# EAGLE design untitled (EAGLE 7.7.0)
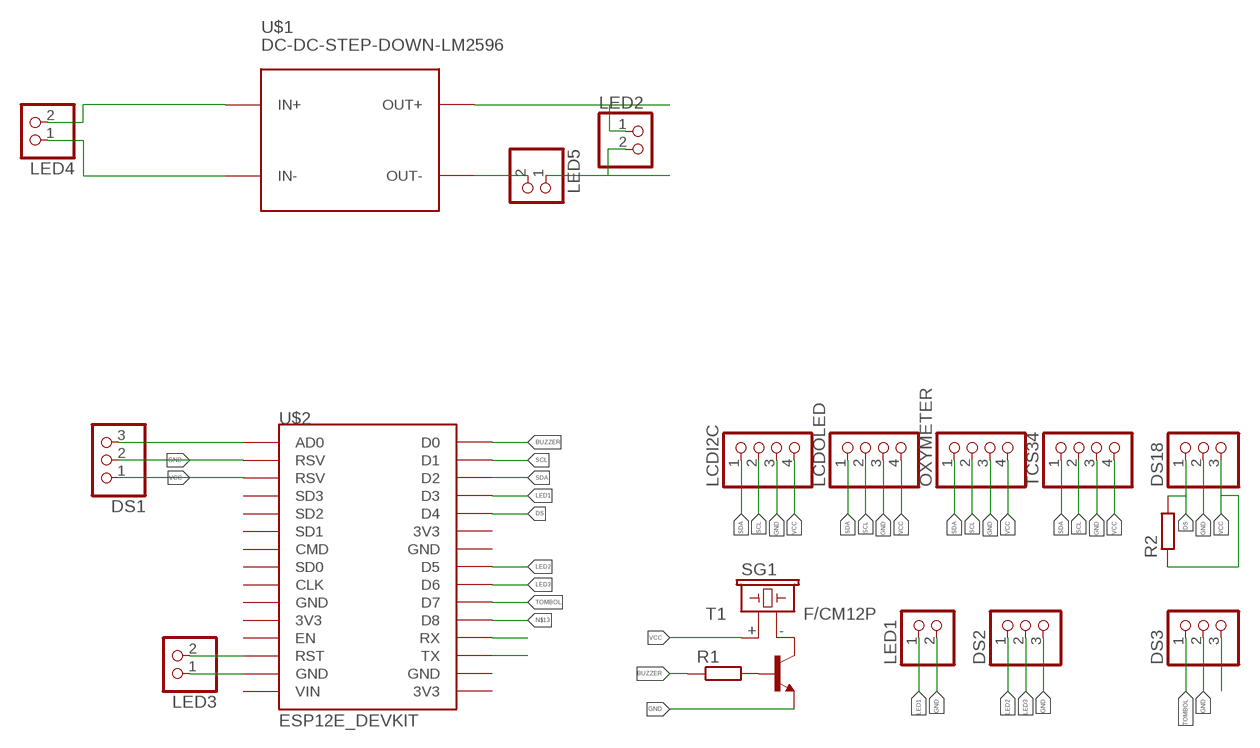
[diagram p0: schematic, sheet 1]

## Parts
DS1  PINHD-1X3  [1X03]
DS2  PINHD-1X3  [1X03]
DS3  PINHD-1X3  [1X03]
DS18  PINHD-1X3  [1X03]
LCDI2C  PINHD-1X4  [1X04]
LCDOLED  PINHD-1X4  [1X04]
LED1  PINHD-1X2  [1X02]
LED2  PINHD-1X2  [1X02]
LED3  PINHD-1X2  [1X02]
LED4  PINHD-1X2  [1X02]
LED5  PINHD-1X2  [1X02]
OXYMETER  PINHD-1X4  [1X04]
R1  R-EU_0207/10  [0207/10]
R2  R-EU_0207/10  [0207/10]
SG1  F/CM12P  [F/CM12P]
T1  -NPN-TO92  [TO92]
TCS34  PINHD-1X4  [1X04]
U$1  DC-DC-STEP-DOWN-LM2596  [DC-DC-STEP-DOWN-LM2596]
U$2  ESP12E_DEVKIT  [ESP12E_DEVKIT]

## Nets
BUZZER: R1.1 U$2.D0
DS: DS18.1 R2.2 U$2.D4
GND: DS1.2 DS2.3 DS3.2 DS18.2 LCDI2C.3 LCDOLED.3 LED1.2 LED2.2 LED5.1 OXYMETER.3 T1.1(E) TCS34.3 U$2.RSV@0(RSV)
LED1: LED1.1 U$2.D3
LED2: DS2.1 U$2.D5
LED3: DS2.2 U$2.D6
N$2: LED3.2 U$2.RST
N$3: SG1.- T1.3(C)
N$4: R1.2 T1.2(B)
N$5: LED4.2 U$1.IN+
N$6: LED4.1 U$1.IN-
N$7: LED5.2 U$1.OUT-
N$8: LED3.1 U$2.GND@1(GND)
N$13: U$2.D8
N$14: DS1.3 U$2.AD0
N$15: U$2.RX
N$16: U$2.TX
SCL: LCDI2C.2 LCDOLED.2 OXYMETER.2 TCS34.2 U$2.D1
SDA: LCDI2C.1 LCDOLED.1 OXYMETER.1 TCS34.1 U$2.D2
TOMBOL: DS3.1 U$2.D7
VCC: DS1.1 DS3.3 DS18.3 LCDI2C.4 LCDOLED.4 LED2.1 OXYMETER.4 R2.1 SG1.+ TCS34.4 U$1.OUT+ U$2.RSV@1(RSV)
Unconnected: U$2.3V3@0(3V3) U$2.3V3@1(3V3) U$2.3V3@2(3V3) U$2.CLK U$2.CMD U$2.EN U$2.GND@0(GND) U$2.GND@2(GND) U$2.GND@3(GND) U$2.SD0 U$2.SD1 U$2.SD2 U$2.SD3 U$2.VIN

## Library data of the parts
DS1-DS3 DS18 = pinhead:PINHD-1X3: PIN HEADER
LCDI2C LCDOLED OXYMETER TCS34 = pinhead:PINHD-1X4: PIN HEADER
LED1-LED5 = pinhead:PINHD-1X2: PIN HEADER
R1 R2 = rcl:R-EU_: RESISTOR, European symbol
SG1 = buzzer:F/CM12P: BUZZER Source: Buerklin
T1 = transistor:*-NPN-: NPN Transistror BF959 corrected 2008.03.06
U$1 = diy-modules:DC-DC-STEP-DOWN-LM2596: DC/DC Step-Down Regulator based on LM2596-ADJ chip LM2596 datasheet available here: http://www.ti.com/lit/ds/symlink/lm2596.pdf Click here to find device on ebay.com <http://www.ebay.com/sch/lm2596+power+regulator>
U$2 = ESP12E_DEVKIT:ESP12E_DEVKIT: ESP12E DEVKIT BOARD

## Board
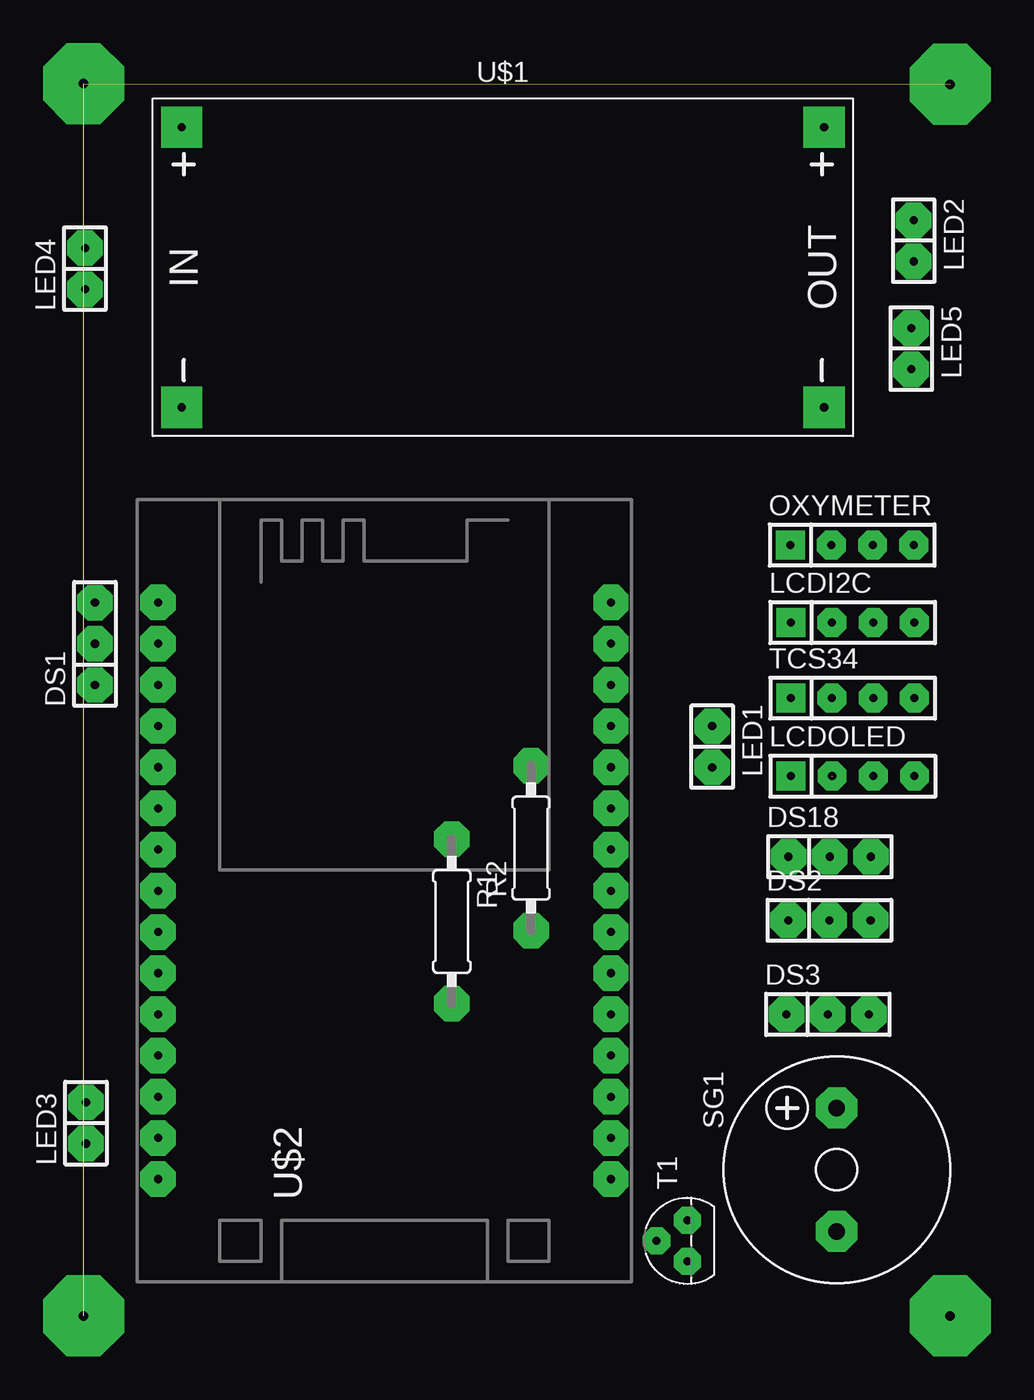
[diagram p1: board, top side]
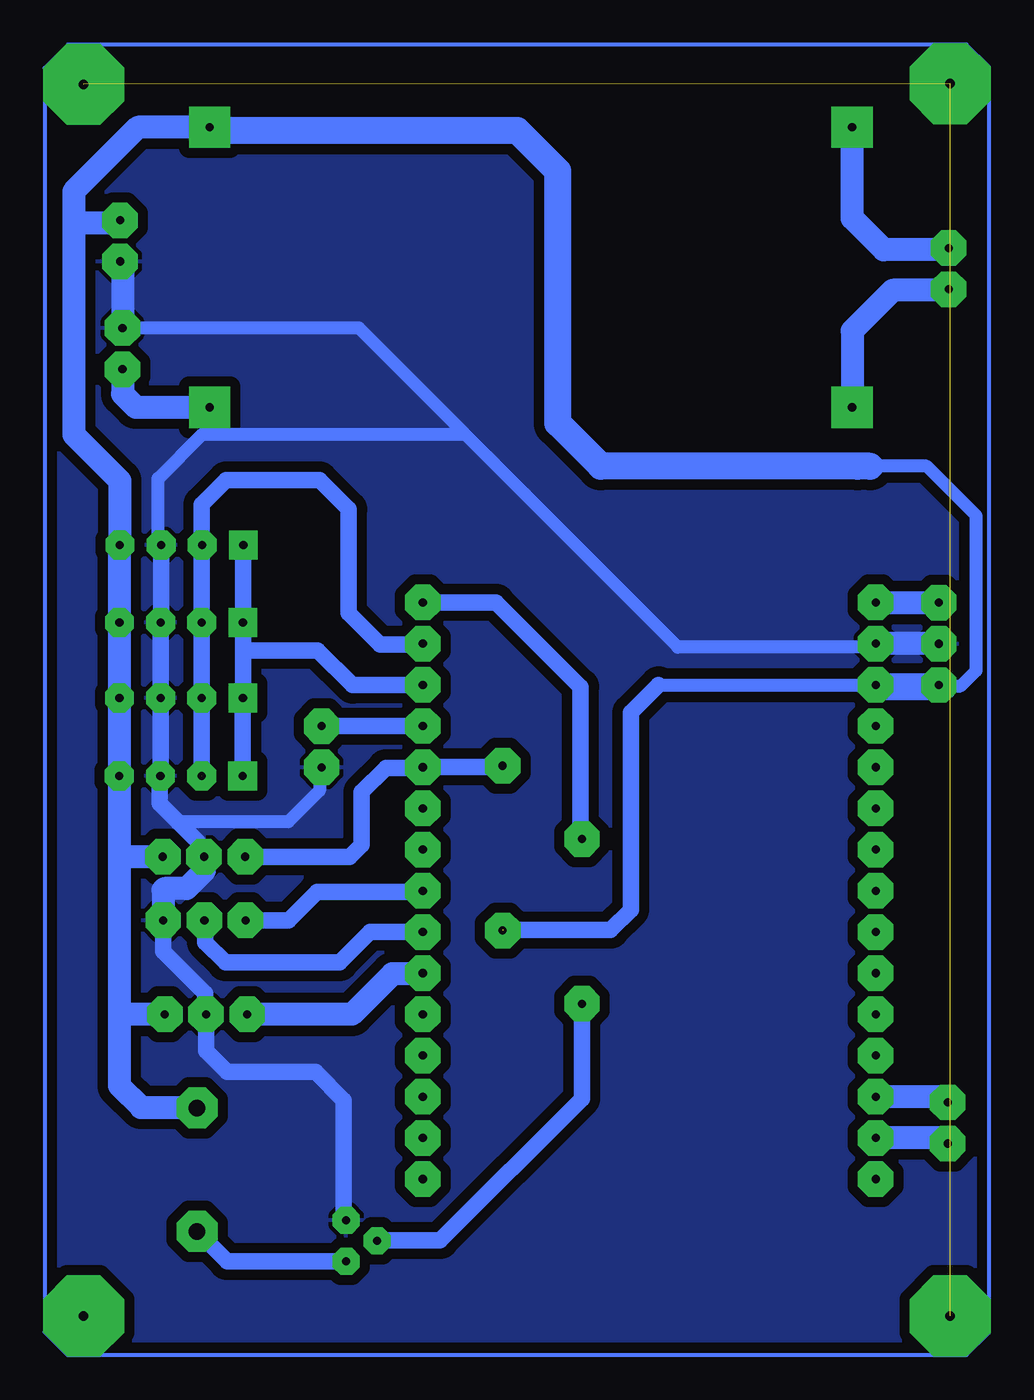
[diagram p2: board, bottom side, seen from below]

No outline drawn. Coordinates in mm, seen from the top.
Copper layers (1*16): Top 0.035mm / dielectric 1.5mm / Bottom 0.035mm
Design rules "default *": minimum track width 10mil, minimum drill 24mil, track to track 25mil, track to pad 25mil, pad to pad 25mil, via to via 25mil, smd to smd 25mil, copper to edge 40mil, drill to drill 25mil, minimum pad ring 10mil, minimum via ring 8mil, stop-mask expansion 4mil, vias tented up to drill 0mil, thermal gap 10mil

### Footprints (pad centres in the part's own frame; a part is rotated, then mirrored left to right if it is on the bottom)
1X03 = drill 0.5 pad 2.184 octagon: 1 -2.54,0; 2 0,0; 3 2.54,0
1X04 = drill 0.5 pad 1.778 square: 1 -3.81,0 | drill 0.5 pad 1.778 octagon: 2 -1.27,0; 3 1.27,0; 4 3.81,0
1X02 = drill 0.5 pad 2.184 octagon: 1 -1.27,0; 2 1.27,0
0207/10 = drill 0.5 pad 2.184 octagon: 1 -5.08,0; 2 5.08,0
F/CM12P = drill 1.016 pad 2.54 octagon: + 3.81,0; - -3.81,0
TO92 = drill 0.5 pad 1.676 octagon: 1 1.27,0; 2 0,1.905; 3 -1.27,0
DC-DC-STEP-DOWN-LM2596 = drill 0.5 pad 2.54 square: IN+ -19.812,8.636; IN- -19.812,-8.636; OUT+ 19.812,8.636; OUT- 19.812,-8.636
ESP12E_DEVKIT = drill 0.5 pad 2.184 octagon: 3V3@0 -11.43,-7.62; 3V3@1 16.51,5.08; 3V3@2 16.51,-17.78; AD0 -11.43,17.78; CLK -11.43,-2.54; CMD -11.43,2.54; D0 16.51,17.78; D1 16.51,15.24; D2 16.51,12.7; D3 16.51,10.16; D4 16.51,7.62; D5 16.51,0; D6 16.51,-2.54; D7 16.51,-5.08; D8 16.51,-7.62; EN -11.43,-10.16; GND@0 -11.43,-5.08; GND@1 -11.43,-15.24; GND@2 16.51,2.54; GND@3 16.51,-15.24; RST -11.43,-12.7; RSV@0 -11.43,15.24; RSV@1 -11.43,12.7; RX 16.51,-10.16; SD0 -11.43,0; SD1 -11.43,5.08; SD2 -11.43,7.62; SD3 -11.43,10.16; TX 16.51,-12.7; VIN -11.43,-17.78

### Placement (x,y rotation side)
DS1  4.05,54.25 90 top
DS2  49.35,37.2 0 top
DS3  49.25,31.4 0 top
DS18  49.37,41.12 0 top
LCDI2C  50.78,55.56 0 top
LCDOLED  50.79,46.09 0 top
LED1  42.12,47.9 270 top
LED2  54.55,79.1 270 top
LED3  3.5,24.7 90 top
LED4  3.44,77.39 90 top
LED5  54.4,72.45 270 top
OXYMETER  50.75,60.34 0 top
R1  26.06,37.13 270 top
R2  30.95,41.65 90 top
SG1  49.8,21.82 90 top
T1  40.6,17.43 90 top
TCS34  50.78,50.9 0 top
U$1  29.21,77.47 0 top
U$2  19.37,39.02 0 top

### Tracks (layer width: path | path; a pad name or v marks a point on that pad's centre or on a via)
BUZZER
  Bottom 1.016: R1.1 26.15,42.3 26.15,51.6 31.35,56.8 U$2.D0
DS
  Bottom 1.016: R2.2 31.04,46.64 U$2.D4 35.92,46.6 38.15,46.6 39.65,45.1 39.65,41.85 40.38,41.12 DS18.1
GND
  Bottom 0.813: LED1.2 42.25,46.35 42.25,45.2 44.17,43.27 50.98,43.27 | U$2.RSV@0 8.15,54.05 20.15,54.05 33.27,67.17 | 33.27,67.17 39.82,73.72 LED5.1 | OXYMETER.3 52.2,60.52 52.2,64.45 49.48,67.17 33.27,67.17
  Bottom 1.016: 51.91,37.22 DS2.3 51.89,35.29 49.3,32.7 49.3,31.45 DS3.2 49.25,29.15 47.95,27.85 42.5,27.85 40.75,26.1 40.75,18.85 T1.1 | 52.05,60.34 OXYMETER.3 52.02,55.59 LCDI2C.3 TCS34.3 LCDOLED.3 52.1,46.04 52.1,44.4 50.98,43.27 49.37,41.67 DS18.2
  Bottom 1.422: DS18.2 49.35,41.1 49.35,40.25 50.45,39.15 51.8,39.15 51.89,39.06 DS2.3 | LED2.2 54.4,77.68 LED5.1 | DS1.2 U$2.RSV@0
  pour Bottom: 15.75,91.2 57.75,91.2 59.2,89.75 59.2,11.8 57.8,10.4 2.35,10.4 0.95,11.8 0.95,89.8 2.35,91.2 14.75,91.2
LED1
  Bottom 1.016: LED1.1 U$2.D3
LED2
  Bottom 1.016: U$2.D5 35.95,38.95 42.4,38.95 44.15,37.2 DS2.1
LED3
  Bottom 1.016: DS2.2 49.3,37.15 49.3,35.85 48.05,34.6 41,34.6 39.12,36.48 U$2.D6
N$1  (via drill 0.6 pad 5)  (2 unrouted)
  other vias: 3.35,88.8 56.8,88.75 3.35,12.8
N$2
  Bottom 1.422: LED3.2 3.85,26.32 U$2.RST
N$3
  Bottom 1.016: SG1.- 47.95,16.16 T1.3
N$4
  Bottom 1.016: T1.2 38.67,17.45 34.8,17.45 26.06,26.19 R1.2
N$5
  Bottom 1.422: LED4.2 3.55,78.55 7.45,78.55 9.4,80.5 U$1.IN+
N$6
  Bottom 1.422: LED4.1 3.51,76.05 6.9,76.05 9.4,73.55 U$1.IN-
N$7
  Bottom 1.422: LED5.2 54.4,69.65 53.58,68.83 U$1.OUT-
N$8
  Bottom 1.422: LED3.1 3.85,23.78 U$2.GND@1
N$9  (via drill 0.6 pad 5)
  other vias: 56.8,12.8
N$10
  Bottom 0.254: 2.35,91.2 57.75,91.2 59.2,89.75 59.2,11.8 57.8,10.4 2.35,10.4 0.95,11.8 0.95,89.8 2.35,91.2
N$14
  Bottom 1.422: U$2.AD0 DS1.3
SCL  (1 unrouted)
  Bottom 1.016: 49.51,60.34 OXYMETER.2 49.51,60.31 | LCDOLED.2 TCS34.2 LCDI2C.2 49.51,59.85 49.51,60.31 | U$2.D1 35.94,54.2 38.5,54.2 40.45,56.15 40.45,62.55 42.25,64.35 48,64.35 49.51,62.84 49.51,60.31
SDA
  Bottom 1.016: 46.97,60.34 OXYMETER.1 46.97,60.31 LCDI2C.1 46.97,53.85 | TCS34.1 | TCS34.1 46.97,53.85 | TCS34.1 LCDOLED.1 | U$2.D2 35.9,51.7 40.2,51.7 42.35,53.85 46.97,53.85
TOMBOL
  Bottom 1.422: U$2.D7 35.92,33.9 37.75,33.9 40.25,31.4 DS3.1
VCC  (1 unrouted)
  Bottom 0.813: 21.33,51.72 21.3,51.75 21.27,51.72 U$2.RSV@1 | 3.65,51.5 3.5,51.65 2.7,51.65 1.75,52.6 1.75,62.15 4.8,65.2 9.05,65.2
  Bottom 1.016: 30.92,36.6 24.3,36.6 23.05,37.85 23.05,50 21.33,51.72 | 54.59,60.34 OXYMETER.4 54.59,60.31
  Bottom 1.422: U$1.OUT+ 53.45,86.1 57.4,82.15 57.4,80.2 | 54.59,60.31 LCDI2C.4 TCS34.4 LCDOLED.4 54.6,41.2 | 54.6,41.2 54.6,31.5 | 54.6,31.5 54.6,27 53.25,25.65 49.82,25.65 SG1.+ | DS3.3 54.5,31.4 54.6,31.5 | DS18.3 54.52,41.12 54.6,41.2 | 57.4,80.2 57.4,67.15 54.56,64.31 OXYMETER.4 | LED2.1 54.72,80.2 57.4,80.2 | DS1.1 U$2.RSV@1 | 7.91,51.75 7.66,51.5 3.65,51.5
  Bottom 1.676: U$2.RSV@1 7.91,51.75 | 8.3,65.2 9.05,65.2 24.9,65.2 27.55,67.85 27.55,83.4 30.05,85.9 48.82,85.9 U$1.OUT+